# Altium schematic sheet MCU.SchDoc
size A; SheetNumber: 1; SheetTotal: 5
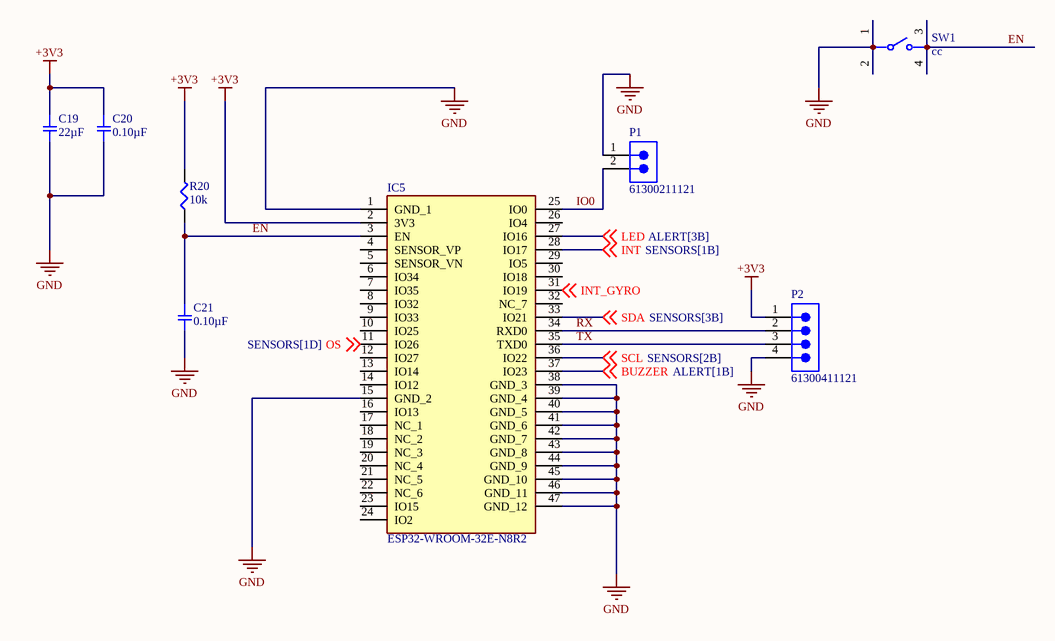
[diagram p0: MCU.SchDoc]

## Parts
C19  22µF  [SMD-0603C]
C20  0.10µF  [SMD-0603C]
C21  0.10µF  [SMD-0402C]
IC5  ESP32-WROOM-32E-N8R2  [ESP32WROOM32EN8R2]
P1  61300211121  [61300211121]
P2  61300411121  [61300411121]
R20  10k  [SMD-0402-RES]
SW1  cc  [FP-TL3305AF260QG-MFG]

## Nets
+3V3: C19.1 C20.1 IC5.2(3V3) P2.1 R20.2
GND: C19.2 C20.2 C21.2 IC5.1(GND_1) IC5.15(GND_2) IC5.38(GND_3) IC5.39(GND_4) IC5.40(GND_5) IC5.41(GND_6) IC5.42(GND_7) IC5.43(GND_8) IC5.44(GND_9) IC5.45(GND_10) IC5.46(GND_11) IC5.47(GND_12) P1.1 P2.4 SW1.1 SW1.2
BUZZER: IC5.37(IO23) ; off-sheet BUZZER
EN: C21.1 IC5.3(EN) R20.1 SW1.3 SW1.4
INT: IC5.28(IO17) ; off-sheet INT
INT_GYRO: IC5.31(IO19) ; off-sheet INT_GYRO
IO0: IC5.25(IO0) P1.2
LED: IC5.27(IO16) ; off-sheet LED
OS: IC5.11(IO26) ; off-sheet OS
RX: IC5.34(RXD0) P2.2
SCL: IC5.36(IO22) ; off-sheet SCL
SDA: IC5.33(IO21) ; off-sheet SDA
TX: IC5.35(TXD0) P2.3

Not connected (* = marked no-connect by the designer): IC5 4(SENSOR_VP) 5(SENSOR_VN) 6(IO34) 7(IO35) 8(IO32) 9(IO33) 10(IO25) 12(IO27) 13(IO14) 14(IO12) 16(IO13) 17(NC_1) 18(NC_2) 19(NC_3) 20(NC_4) 21(NC_5) 22(NC_6) 23(IO15) 24(IO2) 26(IO4) 29(IO5) 30(IO18) 32(NC_7)

## Library data of the parts
C19 = ZRB18AR60J226ME01L: CAP CER 22UF 6.3V X5R 0603; Manufacturer: Murata Electronics North America; Factory Stock: 0; Unit Price (USD): 0.44; Minimum Quantity: 1; Tolerance: ±20%; Datasheets: http://search.murata.co.jp/Ceramy/image/img/A01X/G101/ENG/ZRB18AR60J226ME01-01.pdf; Image: //media.digikey.com/Renders/Murata%20Renders/ZRB-SERIES-0603.jpg; Digi-Key Part Number: 490-10988-1-ND; Part Number: ZRB18AR60J226ME01L; Quantity Available: 3040; @ qty: 0; Packaging: Cut Tape (CT); Series: ZRB; Part Status: Active; Value: 22µF; Voltage: 6.3V; Temperature Coefficient: X5R; Operating Temperature: -55°C ~ 85°C; Features: Derating Recommended, Interposer Termination; Ratings: -; Applications: Acoustic Noise Reduction; Mounting Type: Surface Mount, MLCC; Package / Case: 0603 (1608 Metric); Size / Dimension: 0.063" L x 0.031" W (1.60mm x 0.80mm); Height - Seated (Max): -; Thickness (Max): 0.047" (1.20mm); Lead Spacing: -; Lead Style: -
C20 = GCJ188R71C104KA01D: CAP CER 0.1UF 16V X7R 0603; Manufacturer: Murata Electronics North America; Factory Stock: 0; Unit Price (USD): 0.21; Minimum Quantity: 1; Tolerance: ±10%; Datasheets: http://www.murata.com/~/media/webrenewal/support/library/catalog/products/capacitor/mlcc/c03e.ashx; Image: //media.digikey.com/Renders/Murata%20Renders/0603%28LQG18%29.jpg; Digi-Key Part Number: 490-5796-1-ND; Part Number: GCJ188R71C104KA01D; Quantity Available: 22473; @ qty: 0; Packaging: Cut Tape (CT); Series: GCJ; Part Status: Active; Value: 0.10µF; Voltage: 16V; Temperature Coefficient: X7R; Operating Temperature: -55°C ~ 125°C; Features: Soft Termination; Ratings: AEC-Q200; Applications: Automotive, Boardflex Sensitive; Mounting Type: Surface Mount, MLCC; Package / Case: 0603 (1608 Metric); Size / Dimension: 0.063" L x 0.031" W (1.60mm x 0.80mm); Height - Seated (Max): -; Thickness (Max): 0.035" (0.90mm); Lead Spacing: -; Lead Style: -
C21 = GCM155R71C104KA55D: CAP CER 0.1UF 16V X7R 0402; Manufacturer: Murata Electronics North America; Factory Stock: 0; Unit Price (USD): 0.1; Minimum Quantity: 1; Tolerance: ±10%; Datasheets: http://www.murata.com/~/media/webrenewal/support/library/catalog/products/capacitor/mlcc/c03e.ashx; Image: //media.digikey.com/Renders/Murata%20Renders/ZRB-SERIES-0402.jpg; Digi-Key Part Number: 490-4759-1-ND; Part Number: GCM155R71C104KA55D; Quantity Available: 734194; @ qty: 0; Packaging: Cut Tape (CT); Series: GCM; Part Status: Active; Value: 0.10µF; Voltage: 16V; Temperature Coefficient: X7R; Operating Temperature: -55°C ~ 125°C; Features: -; Ratings: AEC-Q200; Applications: Automotive; Mounting Type: Surface Mount, MLCC; Package / Case: 0402 (1005 Metric); Size / Dimension: 0.039" L x 0.020" W (1.00mm x 0.50mm); Height - Seated (Max): -; Thickness (Max): 0.022" (0.55mm); Lead Spacing: -; Lead Style: -
IC5 = ESP32-WROOM-32E-N8R2: Integrated Circuit; Manufacturer_Name: Espressif Systems; Datasheet Link: https://www.espressif.com/sites/default/files/documentation/esp32-wroom-32e_esp32-wroom-32ue_datasheet_en.pdf; Height: 3.25mm; Manufacturer_Part_Number: ESP32-WROOM-32E-N8R2; Mouser Part Number: 356-ESP32WRM32EN8R2; Mouser Price/Stock: https://www.mouser.co.uk/ProductDetail/Espressif-Systems/ESP32-WROOM-32E-N8R2?qs=By6Nw2ByBD0mvGJSS3Ohlw%3D%3D
P1 = CMP-1712-00002-6: NexarPartId: 20081794; Number of Contacts: 2; Pitch: 2.54mm; Connector Type: Male Pin; Voltage Rating: 250V; Current Rating: 3A; Gender: Male; Contact Resistance: 20mΩ; Height: 8.94mm; Lead Free: Lead Free; Number of Pins: 2; Termination: Through Hole; RoHS: Compliant; Lead Pitch: 2.54mm; REACH SVHC: No SVHC; Housing Material: PBT; Contact Mating Length: 5.9944mm; Min Operating Temperature: -40°C; Orientation: Vertical; Contact Material: Copper; Contact Gender: Male; Max Operating Temperature: 125°C; Number of Rows: 1; Number of Positions: 2; Packaging: Bulk; Contact Plating: Gold; Mount: Through Hole; Color: Black; Operating Supply Voltage: 250V
P2 = CMP-1502-01064-3: NexarPartId: 32855522; Operating Supply Voltage: 250V; Pitch: 2.54mm; Contact Resistance: 20mΩ; Number of Positions: 4; Current Rating: 3A; Connector Type: Male Pin; Gender: Male; Contact Plating: Gold; Height: 8.89mm; Lead Pitch: 2.54mm; Lead Free: Lead Free; Contact Mating Length: 5.9944mm; Number of Rows: 1; Termination: Solder; Packaging: Bulk; REACH SVHC: Unknown; Min Operating Temperature: -40°C; RoHS: Compliant; Number of Contacts: 4; Voltage Rating: 250V; Color: Black; Max Operating Temperature: 105°C; Contact Material: Copper; Mount: Through Hole; Orientation: Vertical; Number of Pins: 4
R20 = ERJ-2GEJ103X: RES SMD 10K OHM 5% 1/10W 0402; Manufacturer: Panasonic Electronic Components; Factory Stock: 0; Unit Price (USD): 0.00350; @ qty: 1500; Minimum Quantity: 1; Power (Watts): 0.1W, 1/10W; Temperature Coefficient: ±200ppm/°C; Part Number: ERJ-2GEJ103X; Datasheets: http://industrial.panasonic.com/www-cgi/jvcr13pz.cgi?E+PZ+3+AOA0001+ERJ2GEJ103X+7+WW; Image: //media.digikey.com/Photos/Panasonic%20Photos/ERJ-PA2-Series.jpg; Digi-Key Part Number: P10KJCT-ND; Quantity Available: 2560215; Packaging: Cut Tape (CT); Series: ERJ; Part Status: Active; Value: 10k; Tolerance: ±5%; Composition: Thick Film; Features: Automotive AEC-Q200; Operating Temperature: -55°C ~ 155°C; Package / Case: 0402 (1005 Metric); Supplier Device Package: 0402; Size / Dimension: 0.039" L x 0.020" W (1.00mm x 0.50mm); Height - Seated (Max): 0.016" (0.40mm); Number of Terminations: 2; Failure Rate: -
SW1 = CMP-17879-000010-1: SWITCH TACTILE SPST-NO 50MA 12V; Mechanical Life: 200000Cycles; Switch Function: Off-Mom; Actuator Type: Standard; Operating Force: 260gf; Illumination Type: Non-Illuminated; Switch Travel: 0.2mm; Throw Configuration: SPST; Min Operating Temperature: -20°C; Max Operating Temperature: 70°C; Lead Free: Lead Free; Mount: Surface Mount; Packaging: Tape and Reel; Termination: Gull Wing